# EAGLE design Dilbert-Badge (EAGLE 6.5.0)
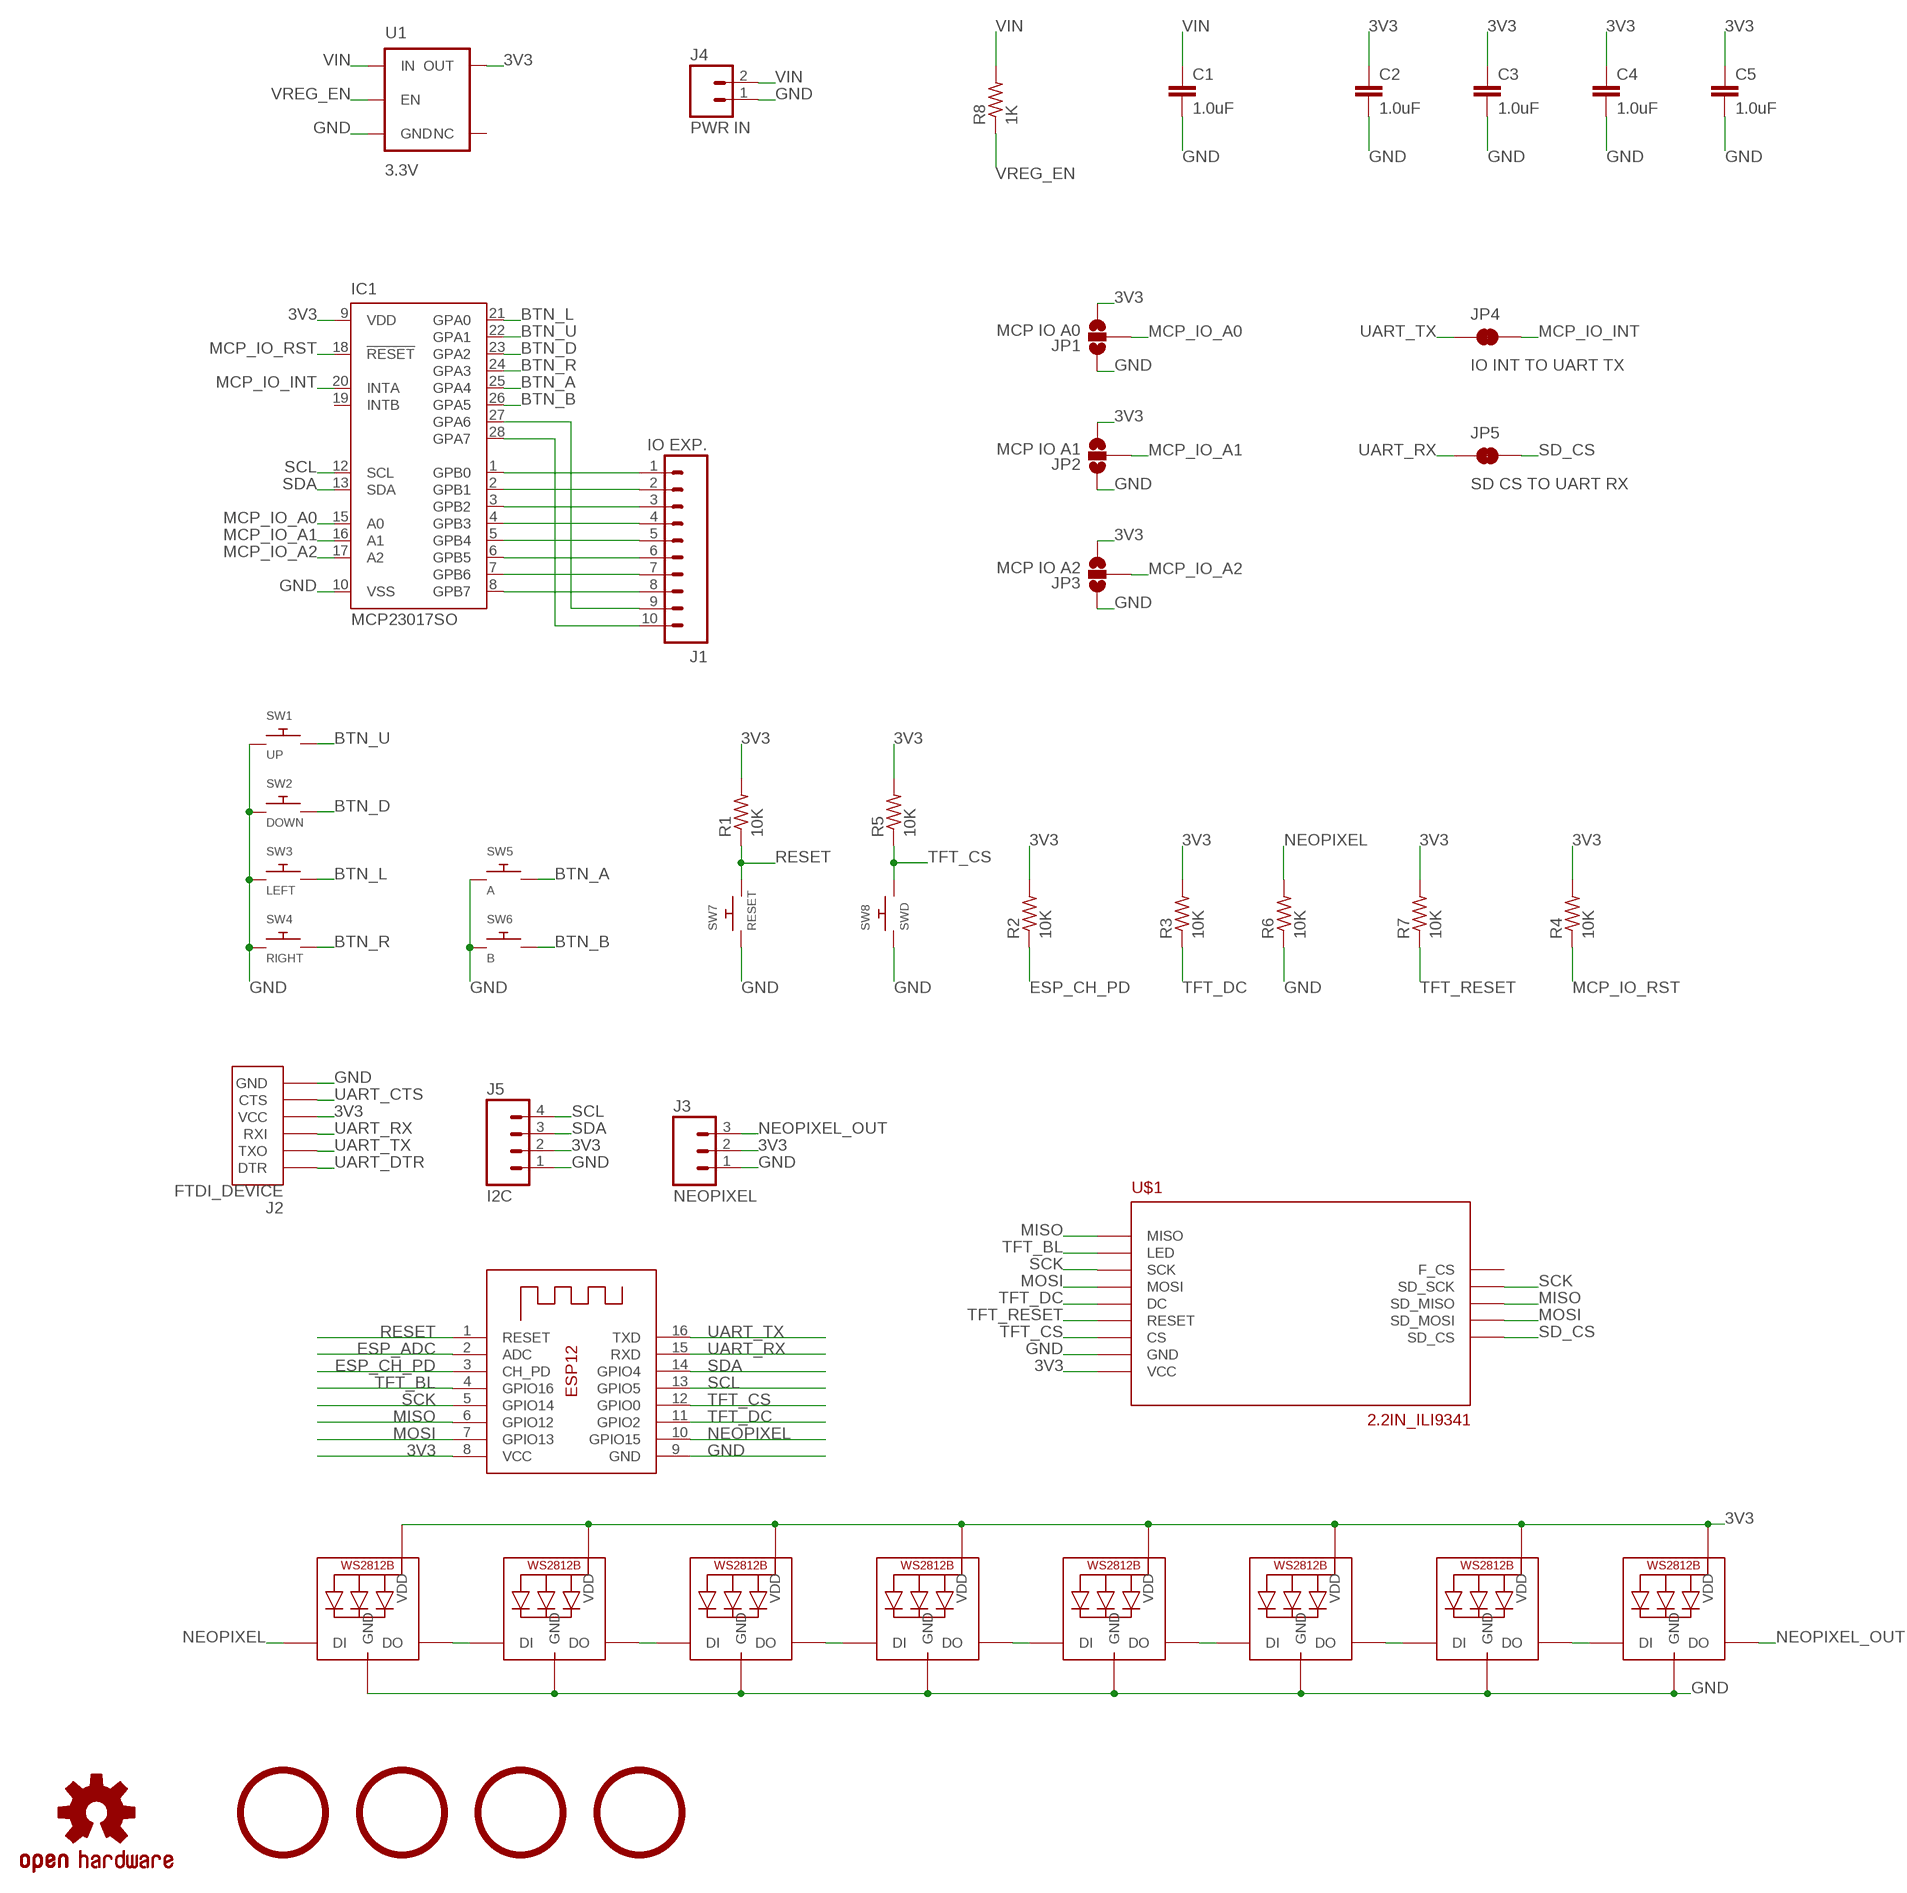
[diagram p0: schematic, sheet 1]

## Parts
C1  1.0uF  1.0UF-25V-+80/-20(0805)"  [0805-CAP]
C2  1.0uF  1.0UF-25V-+80/-20(0805)"  [0805-CAP]
C3  1.0uF  1.0UF-25V-+80/-20(0805)"  [0805-CAP]
C4  1.0uF  1.0UF-25V-+80/-20(0805)"  [0805-CAP]
C5  1.0uF  1.0UF-25V-+80/-20(0805)"  [0805-CAP]
IC1  MCP23017SO  [SO28W]
J1  IO EXP.  M10SILK_FEMALE_PTH  [1X10]
J2  FTDI_DEVICE  [FTDI_DEVICE_SIDE]
J3  NEOPIXEL  M03PTH  [1X03]
J4  PWR IN  M02PTH  [1X02]
J5  I2C  M04PTH  [1X04]
JP1  MCP IO A0  JUMPER-PAD-3-NOYES_SILK  [PAD-JUMPER-3-NO_YES_SILK]
JP2  MCP IO A1  JUMPER-PAD-3-NOYES_SILK  [PAD-JUMPER-3-NO_YES_SILK]
JP3  MCP IO A2  JUMPER-PAD-3-NOYES_SILK  [PAD-JUMPER-3-NO_YES_SILK]
JP4  IO INT TO UART TX  JUMPER-PAD-2-NC_BY_TRACENO_SILK  [PAD-JUMPER-2-NC_BY_TRACE_NO_SILK]
JP5  SD CS TO UART RX  JUMPER-PAD-2-NC_BY_TRACENO_SILK  [PAD-JUMPER-2-NC_BY_TRACE_NO_SILK]
LED1  WS2812B5050  [WS2812B]
LED2  WS2812B5050  [WS2812B]
LED3  WS2812B5050  [WS2812B]
LED4  WS2812B5050  [WS2812B]
LED5  WS2812B5050  [WS2812B]
LED6  WS2812B5050  [WS2812B]
LED7  WS2812B5050  [WS2812B]
LED8  WS2812B5050  [WS2812B]
LOGO1  OSHW-LOGOL  [OSHW-LOGO-L]
R1  10K  R-US_R0805  [R0805]
R2  10K  R-US_R0805  [R0805]
R3  10K  R-US_R0805  [R0805]
R4  10K  R-US_R0805  [R0805]
R5  10K  R-US_R0805  [R0805]
R6  10K  R-US_R0805  [R0805]
R7  10K  R-US_R0805  [R0805]
R8  1K  R-US_R0805  [R0805]
SW1  UP  SWITCH_PUSHBUTTONEVQ-PE  [TACT_PANA-EVQ]
SW2  DOWN  SWITCH_PUSHBUTTONEVQ-PE  [TACT_PANA-EVQ]
SW3  LEFT  SWITCH_PUSHBUTTONEVQ-PE  [TACT_PANA-EVQ]
SW4  RIGHT  SWITCH_PUSHBUTTONEVQ-PE  [TACT_PANA-EVQ]
SW5  A  SWITCH_PUSHBUTTONEVQ-PE  [TACT_PANA-EVQ]
SW6  B  SWITCH_PUSHBUTTONEVQ-PE  [TACT_PANA-EVQ]
SW7  RESET  SWITCH_PUSHBUTTONEVQ-PE  [TACT_PANA-EVQ]
SW8  SWD  SWITCH_PUSHBUTTONEVQ-PE  [TACT_PANA-EVQ]
U1  3.3V  V_REG_AP2112K-3.3V  [SOT23-5]
U$1  2.2IN_ILI9341  [2.2IN_ILI9341]
U$2  5MM_MOUNTING_HOLE  [5MM_HOLE]
U$3  5MM_MOUNTING_HOLE  [5MM_HOLE]
U$4  5MM_MOUNTING_HOLE  [5MM_HOLE]
U$5  5MM_MOUNTING_HOLE  [5MM_HOLE]
X1  ESP-12  [ESP-12]

## Nets
3V3 [power]: C2.1 C3.1 C4.1 C5.1 IC1.9(VDD) J2.P$4(VCC) J3.2 J5.2 JP1.3 JP2.3 JP3.3 LED1.1-VDD(VDD) LED2.1-VDD(VDD) LED3.1-VDD(VDD) LED4.1-VDD(VDD) LED5.1-VDD(VDD) LED6.1-VDD(VDD) LED7.1-VDD(VDD) LED8.1-VDD(VDD) R1.2 R2.2 R3.2 R4.2 R5.2 R7.2 U1.5(OUT) U$1.VCC X1.8(VCC)
BTN_A: IC1.25(GPA4) SW5.P$2
BTN_B: IC1.26(GPA5) SW6.P$2
BTN_D: IC1.23(GPA2) SW2.P$2
BTN_L: IC1.21(GPA0) SW3.P$2
BTN_R: IC1.24(GPA3) SW4.P$2
BTN_U: IC1.22(GPA1) SW1.P$2
ESP_ADC: X1.2(ADC)
ESP_CH_PD: R2.1 X1.3(CH_PD)
GND [power]: C1.2 C2.2 C3.2 C4.2 C5.2 IC1.10(VSS) J2.P$6(GND) J3.1 J4.1 J5.1 JP1.1 JP2.1 JP3.1 LED1.3-GND(GND) LED2.3-GND(GND) LED3.3-GND(GND) LED4.3-GND(GND) LED5.3-GND(GND) LED6.3-GND(GND) LED7.3-GND(GND) LED8.3-GND(GND) R6.1 SW1.P$1 SW2.P$1 SW3.P$1 SW4.P$1 SW5.P$1 SW6.P$1 SW7.P$1 SW8.P$1 U1.2(GND) U$1.GND X1.9(GND)
MCP_IO_A0: IC1.15(A0) JP1.2
MCP_IO_A1: IC1.16(A1) JP2.2
MCP_IO_A2: IC1.17(A2) JP3.2
MCP_IO_INT: IC1.20(INTA) JP4.2
MCP_IO_RST: IC1.18(!RESET) R4.1
MISO: U$1.MISO U$1.SD_MISO X1.6(GPIO12)
MOSI: U$1.MOSI U$1.SD_MOSI X1.7(GPIO13)
N$3: LED1.2-DOUT(DO) LED2.4-DIN(DI)
N$4: IC1.1(GPB0) J1.1
N$5: IC1.2(GPB1) J1.2
N$6: IC1.3(GPB2) J1.3
N$7: IC1.4(GPB3) J1.4
N$8: IC1.28(GPA7) J1.10
N$9: IC1.27(GPA6) J1.9
N$10: IC1.8(GPB7) J1.8
N$11: IC1.7(GPB6) J1.7
N$12: IC1.6(GPB5) J1.6
N$13: IC1.5(GPB4) J1.5
N$14: LED2.2-DOUT(DO) LED3.4-DIN(DI)
N$15: LED3.2-DOUT(DO) LED4.4-DIN(DI)
N$16: LED4.2-DOUT(DO) LED5.4-DIN(DI)
N$17: LED5.2-DOUT(DO) LED6.4-DIN(DI)
N$18: LED6.2-DOUT(DO) LED7.4-DIN(DI)
N$19: LED7.2-DOUT(DO) LED8.4-DIN(DI)
NEOPIXEL: LED1.4-DIN(DI) R6.2 X1.10(GPIO15)
NEOPIXEL_OUT: J3.3 LED8.2-DOUT(DO)
RESET: R1.1 SW7.P$2 X1.1(RESET)
SCK: U$1.SCK U$1.SD_SCK X1.5(GPIO14)
SCL: IC1.12(SCL) J5.4 X1.13(GPIO5)
SD_CS: JP5.2 U$1.SD_CS
SDA: IC1.13(SDA) J5.3 X1.14(GPIO4)
TFT_BL: U$1.LED X1.4(GPIO16)
TFT_CS: R5.1 SW8.P$2 U$1.CS X1.12(GPIO0)
TFT_DC: R3.1 U$1.DC X1.11(GPIO2)
TFT_RESET: R7.1 U$1.RESET
UART_CTS: J2.P$5(CTS)
UART_DTR: J2.P$1(DTR)
UART_RX: J2.P$3(RXI) JP5.1 X1.15(RXD)
UART_TX: J2.P$2(TXO) JP4.1 X1.16(TXD)
VIN: C1.1 J4.2 R8.2 U1.1(IN)
VREG_EN: R8.1 U1.3(EN)
Unconnected: IC1.19(INTB) U1.4(NC) U$1.F_CS

## Library data of the parts
C1-C5 = SparkFun-Capacitors:1.0UF-25V-+80/-20(0805): CAP-11625; PROD_ID: CAP-11625
IC1 = adafruit:MCP23017: http://ww1.microchip.com/downloads/en/DeviceDoc/21952a.pdf Source: http://ww1.microchip.com/downloads/en/DeviceDoc/21952a.pdf
J1 = SparkFun-Connectors:M10: Header 10 Standard 10-pin 0.1" header. Use with straight break away headers (SKU : PRT-00116), right angle break away headers (PRT-00553), swiss pins (PRT-00743), machine pins (PRT-00117), and female headers (PRT-00115).; PROD_ID: CONN-11563
J2 = SparkFun-Connectors:FTDI_DEVICE: Connector which mates to FTDI basic or FTDI cable.
J3 = SparkFun-Connectors:M03: Header 3 Standard 3-pin 0.1" header. Use with straight break away headers (SKU : PRT-00116), right angle break away headers (PRT-00553), swiss pins (PRT-00743), machine pins (PRT-00117), and female headers (PRT-00115). Molex polarized connector foot print use with SKU : PRT-08232 with associated crimp pins and housings.
J4 = SparkFun-Connectors:M02: Standard 2-pin 0.1" header. Use with - straight break away headers ( PRT-00116) - right angle break away headers (PRT-00553) - swiss pins (PRT-00743) - machine pins (PRT-00117) - female headers (PRT-00115) Molex polarized connector foot print use with: PRT-08233 with associated crimp pins and housings. 2.54_SCREWTERM for use with PRT-10571. 3.5mm Screw Terminal footprints for PRT-08084 5mm Screw Terminal footprints for use with PRT-08432
J5 = SparkFun-Connectors:M04: Header 4 Standard 4-pin 0.1" header. Use with straight break away headers (SKU : PRT-00116), right angle break away headers (PRT-00553), swiss pins (PRT-00743), machine pins (PRT-00117), and female headers (PRT-00115). Molex polarized connector foot print use with SKU : PRT-08231 with associated crimp pins and housings. 1MM SMD Version SKU: PRT-10208; PROD_ID: CONN-09696
JP1-JP3 = SparkFun-Passives:JUMPER-PAD-3-NO
JP4 JP5 = SparkFun-Passives:JUMPER-PAD-2-NC_BY_TRACE
LED1-LED8 = adafruit:WS2812B
LOGO1 = SparkFun-Aesthetics:OSHW-LOGO: Open Source Hardware Logo This logo indicates the piece of hardware it is found on incorporates a OSHW license and/or adheres to the definition of open source hardware found here: http://freedomdefined.org/OSHW
R1-R8 = adafruit:R-US_: RESISTOR, American symbol
SW1-SW8 = adafruit:SWITCH_PUSHBUTTON: Buttons SOFTTOUCHSMD_SJ - Soft touch temporary push button (Super Junk Akihabara) Compatible with SKPMANE010 [Mouser: 688-SKPMAN] C&K_KSS = Digikey: KSS221GLFS
U1 = SparkFun-PowerIC:V_REG_AP2112: AP2112 - 600mA CMOS LDO Regulator w/ Enable The AP2112 is CMOS process low dropout linear regulator with enable function, the regulator delivers a guaranteed 600mA (min.) continuous load current. Features Output Voltage Accuracy: ±1.5% Output Current: 600mA (Min.) Foldback Short Current Protection: 50mA Enable Function to Turn ON/OFF VOUT Low Dropout Voltage (3.3V): 250mV (Typ.) @IOUT=600mA Excellent Load Regulation: 0.2%/A (Typ.) Excellent Line Regulation: 0.02%/V (Typ.) Low Quiescent Current: 55μA (Typ.) Low Standby Current: 0.01μA (Typ.) Low Output Noise: 50μVRMS PSRR: 100Hz -65dB, 1kHz -65dB OTSD Protection Stable with 1.0μF Flexible Cap: Ceramic, Tantalum and Aluminum Electrolytic Operation Temperature Range: -40°C to 85°C ESD: MM 400V, HBM 4000V; PROD_ID: VREG-12457
U$1 = displays:2.2IN_ILI9341
U$2-U$5 = mechanical:5MM_MOUNTING_HOLE
X1 = adafruit:ESP-12

## Net classes
1 power: width 0.508 mm, clearance 0.254 mm

## Board
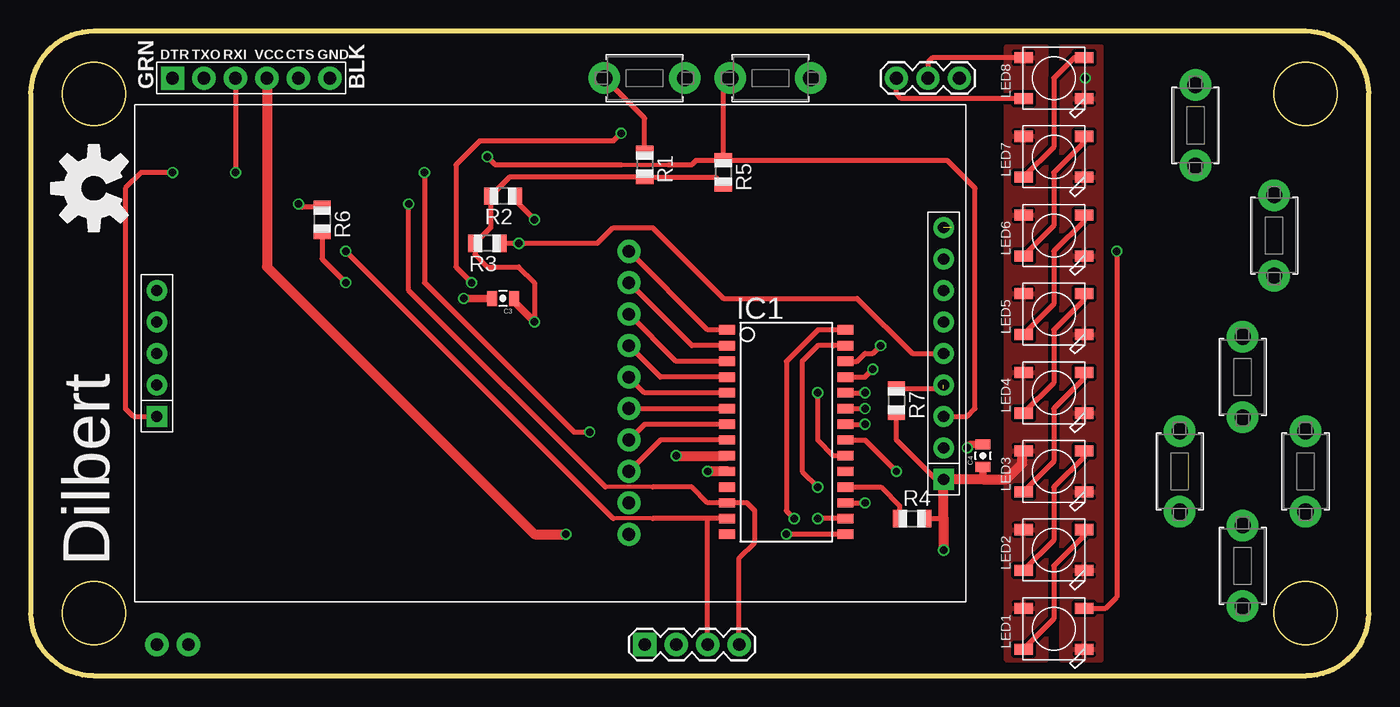
[diagram p1: board, top side]
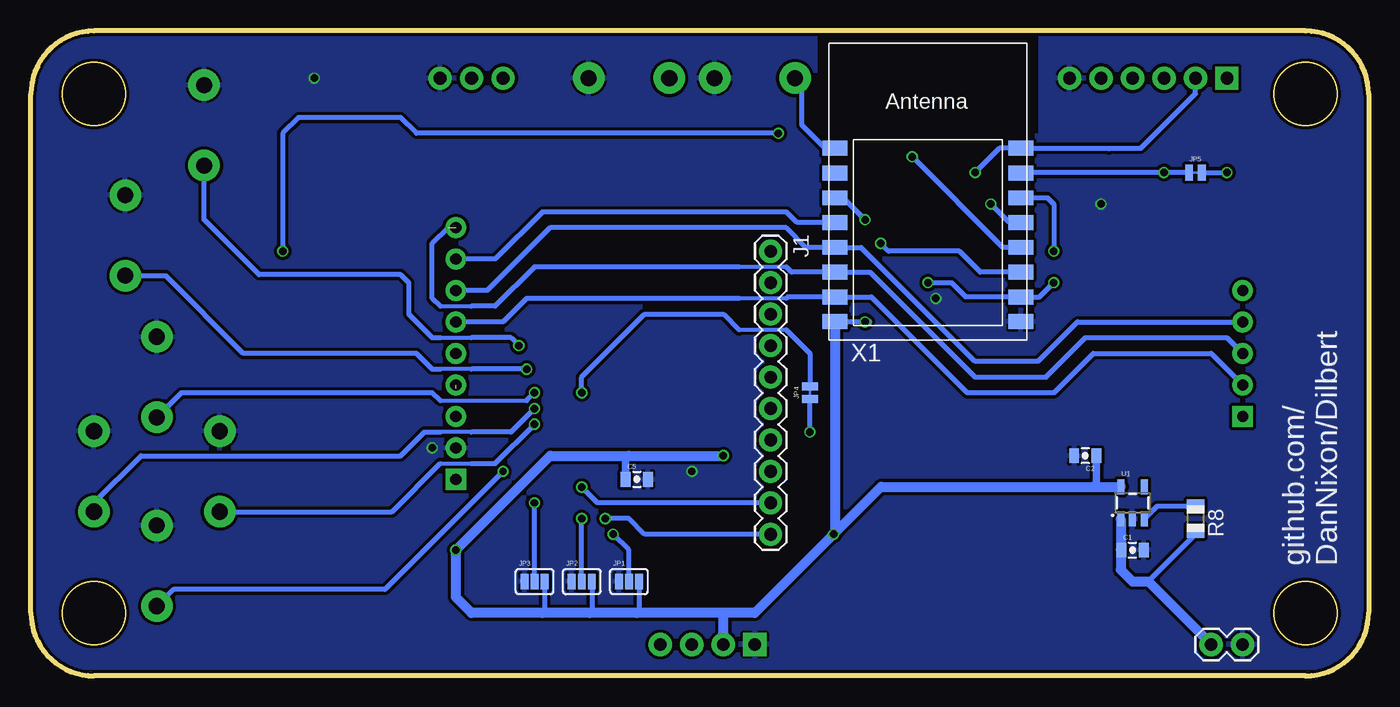
[diagram p2: board, bottom side, seen from below]

Size 107.95 x 52.07 mm. Coordinates in mm from the lower left corner, seen from the top.
Outline: 5.08,52.07 102.87,52.07 arc-90 107.95,46.99 107.95,5.08 arc-90 102.87,0 5.08,0 arc-90 0,5.08 0,46.99 arc-90 5.08,52.07
Copper layers (1*16): Top 0.018mm / dielectric 1.55mm / Bottom 0.018mm
Design rules "eC_2Layer_PClass6_BaseCopperO18_eCDefault": minimum track width 0.15mm, minimum drill 0.35mm, track to track 0.15mm, track to pad 0.15mm, pad to pad 0.15mm, via to via 0.15mm, smd to smd 0mil, copper to edge 0.25mm, drill to drill 0.35mm, minimum pad ring 0.175mm, minimum via ring 0.125mm, stop-mask expansion 0mil, vias tented up to drill 0.45mm, thermal gap 0.2mm
bRestrict: area 26.7,43.8 to 44.4,51.4

### Footprints (pad centres in the part's own frame; a part is rotated, then mirrored left to right if it is on the bottom)
0805-CAP = smd 0.8 x 1.2: 1 -0.9,0; 2 0.9,0
SO28W = smd 0.762 x 1.27: 1 -7.62,-4.78; 2 -6.35,-4.78; 3 -5.08,-4.78; 4 -3.81,-4.78; 5 -2.54,-4.78; 6 -1.27,-4.78; 7 0,-4.78; 8 1.27,-4.78; 9 2.54,-4.78; 10 3.81,-4.78; 11 5.08,-4.78; 12 6.35,-4.78; 13 7.62,-4.78; 14 8.89,-4.78; 15 8.89,4.78; 16 7.62,4.78; 17 6.35,4.78; 18 5.08,4.78; 19 3.81,4.78; 20 2.54,4.78; 21 1.27,4.78; 22 0,4.78; 23 -1.27,4.78; 24 -2.54,4.78; 25 -3.81,4.78; 26 -5.08,4.78; 27 -6.35,4.78; 28 -7.62,4.78
1X10 = drill 1.016 pad 1.88: 1 0,0; 2 2.54,0; 3 5.08,0; 4 7.62,0; 5 10.16,0; 6 12.7,0; 7 15.24,0; 8 17.78,0; 9 20.32,0; 10 22.86,0
FTDI_DEVICE_SIDE = drill 1.016 pad 1.88 square: P$1 -6.35,0 | drill 1.016 pad 1.88: P$2 -3.81,0; P$3 -1.27,0; P$4 1.27,0; P$5 3.81,0; P$6 6.35,0
1X03 = drill 1.016 pad 1.88: 1 0,0; 2 2.54,0; 3 5.08,0
1X02 = drill 1.016 pad 1.88: 1 0,0; 2 2.54,0
1X04 = drill 1.016 pad 1.88 square: 1 0,0 | drill 1.016 pad 1.88: 2 2.54,0; 3 5.08,0; 4 7.62,0
PAD-JUMPER-3-NO_YES_SILK = smd 0.635 x 1.27: 1 -0.813,0; 2 0,0; 3 0.813,0
PAD-JUMPER-2-NC_BY_TRACE_NO_SILK = smd 0.635 x 1.27: 1 -0.508,0; 2 0.508,0
WS2812B = smd 1.5 x 0.9: 1-VDD 2.45,-1.65; 2-DOUT 2.45,1.65; 3-GND -2.45,1.65; 4-DIN -2.45,-1.65
R0805 = smd 1.1 x 1.4: 1 -1,0; 2 1,0
TACT_PANA-EVQ = drill 1.3 pad 2.54: P$1 -3.25,0; P$2 3.25,0
SOT23-5 = smd 0.55 x 1.2: 1 -0.95,-1.3; 2 0,-1.3; 3 0.95,-1.3; 4 0.95,1.3; 5 -0.95,1.3
2.2IN_ILI9341 = drill 0.9 pad 1.676: CS -31.75,5.08; DC -31.75,0; F_CS 31.75,-5.08; GND -31.75,7.62; LED -31.75,-7.62; MISO -31.75,-10.16; MOSI -31.75,-2.54; RESET -31.75,2.54; SCK -31.75,-5.08; SD_MISO 31.75,0; SD_MOSI 31.75,2.54; SD_SCK 31.75,-2.54 | drill 0.9 pad 1.676 square: SD_CS 31.75,5.08; VCC -31.75,10.16
ESP-12 = smd 2 x 1.2: 1 -7.5,4.5; 2 -7.5,2.5; 3 -7.5,0.5; 4 -7.5,-1.5; 5 -7.5,-3.5; 6 -7.5,-5.5; 7 -7.5,-7.5; 8 -7.5,-9.5; 9 7.5,-9.5; 10 7.5,-7.5; 11 7.5,-5.5; 12 7.5,-3.5; 13 7.5,-1.5; 14 7.5,0.5; 15 7.5,2.5; 16 7.5,4.5

### Placement (x,y rotation side)
C1  19.05,10.16 0 bottom
C2  22.86,17.78 180 bottom
C3  38.1,30.48 180 top
C4  76.84,17.78 90 top
C5  59.05,15.87 0 bottom
IC1  60.96,20.32 270 top
J1  48.26,34.29 270 bottom
J2  17.78,48.26 0 top
J3  74.93,48.26 180 top
J4  10.16,2.54 180 bottom
J5  49.53,2.54 0 top
JP1  59.69,7.62 0 bottom
JP2  63.5,7.62 0 bottom
JP3  67.31,7.62 0 bottom
JP4  45.09,22.86 90 bottom
JP5  13.97,40.64 0 bottom
LED1  82.55,3.81 180 top
LED2  82.55,10.16 180 top
LED3  82.55,16.51 180 top
LED4  82.55,22.86 180 top
LED5  82.55,29.21 180 top
LED6  82.55,35.56 180 top
LED7  82.55,41.91 180 top
LED8  82.55,48.26 180 top
LOGO1  5.08,39.37 90 top
R1  49.53,41.27 270 top
R2  38.1,38.73 180 top
R3  36.83,34.93 180 top
R4  71.12,12.7 0 top
R5  55.88,40.64 270 top
R6  23.5,36.83 270 top
R7  69.85,22.23 270 top
R8  13.97,12.7 270 bottom
SW1  92.71,16.51 270 top
SW2  102.87,16.51 270 top
SW3  97.79,8.89 270 top
SW4  97.79,24.13 270 top
SW5  100.33,35.56 270 top
SW6  93.98,44.45 270 top
SW7  49.53,48.26 180 top
SW8  59.69,48.26 180 top
U1  19.05,13.97 0 bottom
U$1  41.91,26.03 180 top
U$2  102.87,5.08 0 top
U$3  102.87,46.99 0 top
U$4  5.08,5.08 0 top
U$5  5.08,46.99 0 top
X1  35.56,38.1 0 bottom

### Tracks (layer width: path | path; a pad name or v marks a point on that pad's centre or on a via)
3V3  (via drill 0.6)
  Top 0.406: LED8.1-VDD 72.77,49.91 72.39,49.53 J3.2 | R5.2 55.24,40.27 R1.2 38.64,40.27 R2.2 37.1,36.2 R3.2 35.83,34.02 36.83,33.02 39.37,33.02 40.64,31.75 v40.64,28.58 | R7.2 69.85,19.05 73.03,15.87 U$1.VCC | R4.2 73.66,12.7
  Top 0.61: C3.1 39,30.22 v40.64,28.58 | C4.1 76.84,15.87
  Top 0.813: LED3.1-VDD 80.01,18.07 80.01,17.15 78.74,15.87 76.84,15.87 U$1.VCC 73.66,12.7 v73.66,10.16 | J2.P$4 19.05,33.02 40.64,11.43 v43.18,11.43 | v52.07,17.78 IC1.9
  Bottom 0.406: JP1.3 58.88,5.26 59.05,5.08 | JP2.3 62.69,5.26 62.86,5.08 | JP3.3 66.5,5.26 66.67,5.08 | X1.8 40.66,28.6 v40.64,28.58
  Bottom 0.61: v40.64,28.58 40.38,28.58 | C5.1 59.95,17.52 59.69,17.78 | C2.1 21.96,15.53 22.23,15.27
  Bottom 0.813: X1.8 43.06,11.55 v43.18,11.43 | v43.18,11.43 49.53,5.08 52.07,5.08 | 52.07,5.08 59.05,5.08 62.86,5.08 66.67,5.08 72.39,5.08 73.66,6.35 v73.66,10.16 66.04,17.78 59.69,17.78 v52.07,17.78 | J5.2 52.07,5.08 | v43.18,11.43 39.34,15.27 22.23,15.27 U1.5
  pour Top: 78.74,50.8 81.92,50.8 81.92,1.27 78.74,1.27
BTN_A  (via drill 0.6)
  Top 0.406: IC1.25 67.31,24.13 v67.95,24.77
  Bottom 0.305: 72.39,24.77 74.93,24.77
  Bottom 0.406: SW5.P$2 97.08,32.31 90.81,26.03 76.84,26.03 75.56,24.77 74.93,24.77 | v67.95,24.77 72.39,24.77
BTN_B  (via drill 0.6)
  Top 0.406: IC1.26 66.67,25.4 67.31,26.03 67.95,26.03 v68.58,26.67
  Bottom 0.305: 74.93,27.3 72.39,27.3
  Bottom 0.406: v68.58,26.67 69.22,27.3 72.39,27.3 | SW6.P$2 93.98,36.83 89.54,32.39 78.11,32.39 77.47,31.75 77.47,29.21 75.56,27.3 74.93,27.3
BTN_D  (via drill 0.6)
  Top 0.406: IC1.23 v67.31,21.59
  Bottom 0.305: 72.39,19.69 74.93,19.69
  Bottom 0.406: SW2.P$2 102.87,13.97 99.06,17.78 78.11,17.78 76.2,19.69 74.93,19.69 | v67.31,21.59 69.22,19.69 72.39,19.69
BTN_L  (via drill 0.6)
  Top 0.406: IC1.21 67.31,19.05 v69.85,16.51
  Bottom 0.406: v69.85,16.51 79.38,6.98 96.45,6.98 SW3.P$2
BTN_R  (via drill 0.6)
  Top 0.406: IC1.24 v67.31,22.86
  Bottom 0.305: 74.93,22.23 67.95,22.23
  Bottom 0.406: v67.31,22.86 67.95,22.23 | 74.93,22.23 75.56,22.86 95.81,22.86 SW4.P$2
BTN_U  (via drill 0.6)
  Top 0.406: IC1.22 v67.31,20.32
  Bottom 0.305: 74.93,17.15 72.39,17.15
  Bottom 0.406: SW1.P$2 78.81,13.26 74.93,17.15 | v67.31,20.32 70.48,17.15 72.39,17.15
ESP_CH_PD  (via drill 0.6)
  Top 0.406: R2.1 39.1,38.37 v40.64,36.83
  Bottom 0.406: X1.3 42.41,38.6 v40.64,36.83
GND  (via drill 0.6)
  Top 0.406: R6.1 21.86,37.83 v21.59,38.1
  Top 0.61: C3.2 v34.92,30.48 | C4.2 75.83,18.68 v75.56,18.41
  Top 0.813: IC1.10 v54.61,16.51
  other vias: 85.09,48.26
  pour Bottom: 0,52.07 107.95,52.07 107.95,0 0,0
  pour Top: 83.19,50.8 86.36,50.8 86.36,1.27 83.19,1.27
MCP_IO_A0  (via drill 0.6)
  Top 0.406: IC1.15 v60.96,11.43
  Bottom 0.406: JP1.2 59.69,10.16 v60.96,11.43
MCP_IO_A1  (via drill 0.6)
  Top 0.406: IC1.16 v63.5,12.7
  Bottom 0.406: JP2.2 v63.5,12.7
MCP_IO_A2  (via drill 0.6)
  Top 0.406: IC1.17 v67.31,13.97
  Bottom 0.406: JP3.2 v67.31,13.97
MCP_IO_INT  (via drill 0.6)
  Top 0.406: IC1.20 64.77,17.78 63.5,19.05 v63.5,22.86
  Bottom 0.305: 46.99,27.94 50.8,27.94
  Bottom 0.406: v63.5,22.86 63.5,24.13 58.42,29.21 52.07,29.21 50.8,27.94 | 46.99,27.94 45.09,26.03 JP4.2
MCP_IO_RST
  Top 0.406: IC1.18 68.58,15.24 70.12,13.7 R4.1
MISO  (1 unrouted)
  Bottom 0.305: 46.99,33.02 50.8,33.02 | 74.93,29.84 72.39,29.84
  Bottom 0.406: 46.99,33.02 46.57,32.6 X1.6 40.22,32.6 31.75,24.13 26.04,24.13 22.86,27.3 11.43,27.3 U$1.SD_MISO | 74.93,29.84 75.56,30.48 75.56,34.93 74.3,36.2 | 50.8,33.02 67.31,33.02 70.48,29.84 72.39,29.84
MOSI
  Bottom 0.305: 46.99,30.48 50.8,30.48
  Bottom 0.406: 46.99,30.48 46.87,30.6 X1.7 40.12,30.6 32.38,22.86 25.4,22.86 22.23,26.03 12.7,26.03 U$1.SD_MOSI | 50.8,30.48 67.95,30.48 69.85,28.58 U$1.MOSI
N$3
  Top 0.406: LED2.4-DIN 85,11.34 82.55,8.89 82.55,4.61 LED1.2-DOUT
N$4
  Top 0.406: IC1.1 54.61,27.94 J1.1
N$5
  Top 0.406: IC1.2 53.34,26.67 J1.2
N$6
  Top 0.406: IC1.3 52.07,25.4 J1.3
N$7
  Top 0.406: IC1.4 50.8,24.13 J1.4
N$8  (via drill 0.6)
  Top 0.406: IC1.28 63.5,27.94 60.96,25.4 60.96,13.33 v61.59,12.7
  Bottom 0.406: J1.10 58.42,11.43 59.69,12.7 v61.59,12.7
N$9  (via drill 0.6)
  Top 0.406: IC1.27 63.5,26.67 62.23,25.4 62.23,16.51 v63.5,15.24
  Bottom 0.406: J1.9 62.23,13.97 v63.5,15.24
N$10
  Top 0.406: IC1.8 50.8,19.05 J1.8
N$11
  Top 0.406: IC1.7 49.53,20.32 J1.7
N$12
  Top 0.406: J1.6 IC1.6
N$13
  Top 0.406: IC1.5 49.53,22.86 J1.5
N$14
  Top 0.406: LED3.4-DIN 85,17.69 82.55,15.24 82.55,10.96 LED2.2-DOUT
N$15
  Top 0.406: LED4.4-DIN 85,24.04 82.55,21.59 82.55,17.31 LED3.2-DOUT
N$16
  Top 0.406: LED5.4-DIN 85,30.39 82.55,27.94 82.55,23.66 LED4.2-DOUT
N$17
  Top 0.406: LED6.4-DIN 85,36.74 82.55,34.29 82.55,30.01 LED5.2-DOUT
N$18
  Top 0.406: LED7.4-DIN 85,43.09 82.55,40.64 82.55,36.36 LED6.2-DOUT
N$19
  Top 0.406: LED8.4-DIN 84.2,49.91 82.55,48.26 82.55,42.71 LED7.2-DOUT
N$20
  Top 0.406: 66.04,26.67 64.77,26.67
NEOPIXEL  (via drill 0.6)
  Top 0.406: v47.62,43.82 46.99,43.18 36.2,43.18 34.29,41.27 34.29,33.02 v35.56,31.75 | v87.63,34.29 87.63,6.35 86.74,5.46 LED1.4-DIN | R6.2 23.5,33.66 v25.4,31.75
  Bottom 0.406: v25.4,31.75 26.55,30.6 X1.10 32.51,30.6 33.66,31.75 v35.56,31.75 | v47.62,43.82 76.84,43.82 78.11,45.09 86.36,45.09 87.63,43.82 v87.63,34.29
NEOPIXEL_OUT
  Top 0.406: LED8.2-DOUT 70.23,46.61 69.85,46.99 J3.3
RESET
  Top 0.406: R1.1 49.53,45.01 SW7.P$2
  Bottom 0.406: X1.1 43.87,42.6 45.72,44.45 45.72,47.7 SW7.P$2
SCK
  Bottom 0.406: U$1.SCK 71.12,31.12 66.04,36.2 46.99,36.2 45.39,34.6 X1.5 40.95,34.6 31.75,25.4 26.67,25.4 23.5,28.58 U$1.SD_SCK
SCL  (via drill 0.6)
  Top 0.305: 50.16,15.24 46.35,15.24
  Top 0.406: J5.4 57.15,9.53 58.42,10.79 58.42,13.33 57.78,13.97 IC1.12 54.61,13.97 53.34,15.24 50.16,15.24 | 46.35,15.24 30.48,31.12 v30.48,38.1
  Bottom 0.406: X1.13 28.98,36.6 v30.48,38.1
SD_CS  (via drill 0.6)
  Top 0.406: v11.43,40.64 8.89,40.64 7.62,39.37 7.62,21.59 8.26,20.95 U$1.SD_CS
  Bottom 0.406: JP5.2 v11.43,40.64
SDA  (via drill 0.6)
  Top 0.305: 50.16,12.7 46.99,12.7
  Top 0.406: IC1.13 54.61,12.7 | J5.3 54.61,12.7 | 46.99,12.7 v25.4,34.29 | 54.61,12.7 50.16,12.7
  Bottom 0.406: X1.14 25.9,38.6 25.4,38.1 v25.4,34.29
TFT_BL
  Bottom 0.406: X1.4 46.12,36.6 46.99,37.47 66.67,37.47 70.48,33.66 U$1.LED
TFT_CS  (via drill 0.6)
  Top 0.305: 47.62,41.27 51.43,41.27
  Top 0.406: v36.83,41.91 37.46,41.27 47.62,41.27 | 51.43,41.27 53.34,41.27 53.7,41.64 R5.1 | R5.1 55.88,47.7 SW8.P$2 | U$1.CS 75.56,20.95 76.2,21.59 76.2,39.37 73.93,41.64 R5.1
  Bottom 0.406: X1.12 29.52,34.6 v36.83,41.91
TFT_DC  (via drill 0.6)
  Top 0.406: R3.1 v39.37,34.93 45.72,34.93 46.99,36.2 50.16,36.2 55.88,30.48 66.67,30.48 71.12,26.03 U$1.DC
  Bottom 0.406: X1.11 31.33,32.6 33.02,34.29 38.73,34.29 v39.37,34.93
TFT_RESET  (1 unrouted)
  Top 0.406: R7.1 73.66,23.23
UART_RX  (via drill 0.6)
  Top 0.406: J2.P$3 v16.51,40.64
  Bottom 0.406: X1.15 28.02,40.64 v16.51,40.64 JP5.1
UART_TX  (via drill 0.6)
  Top 0.406: v31.75,40.64 31.75,31.75 43.81,19.69 v45.09,19.69
  Bottom 0.406: X1.16 18.36,42.6 13.97,46.99 J2.P$2 | X1.16 21.01,42.6 20.96,42.55 | X1.16 29.79,42.6 v31.75,40.64 | v45.09,19.69 JP4.1
VIN
  Bottom 0.406: R8.2 13.97,11.43 17.78,7.62
  Bottom 0.813: C1.1 20,10.21 U1.1 20,8.57 19.05,7.62 17.78,7.62 J4.2
VREG_EN
  Bottom 0.406: R8.1 17.07,13.7 U1.3

### Text on the board
tNames: Dilbert
bNames: github.com/ / DanNixon/Dilbert
tValues: 2016
bValues: DATA | 3V3 | GND | GND | VIN | GND | 3V3 | SDA | SCL